# EAGLE design mini64se-v1.0.9-F4-2s (EAGLE 6.3)
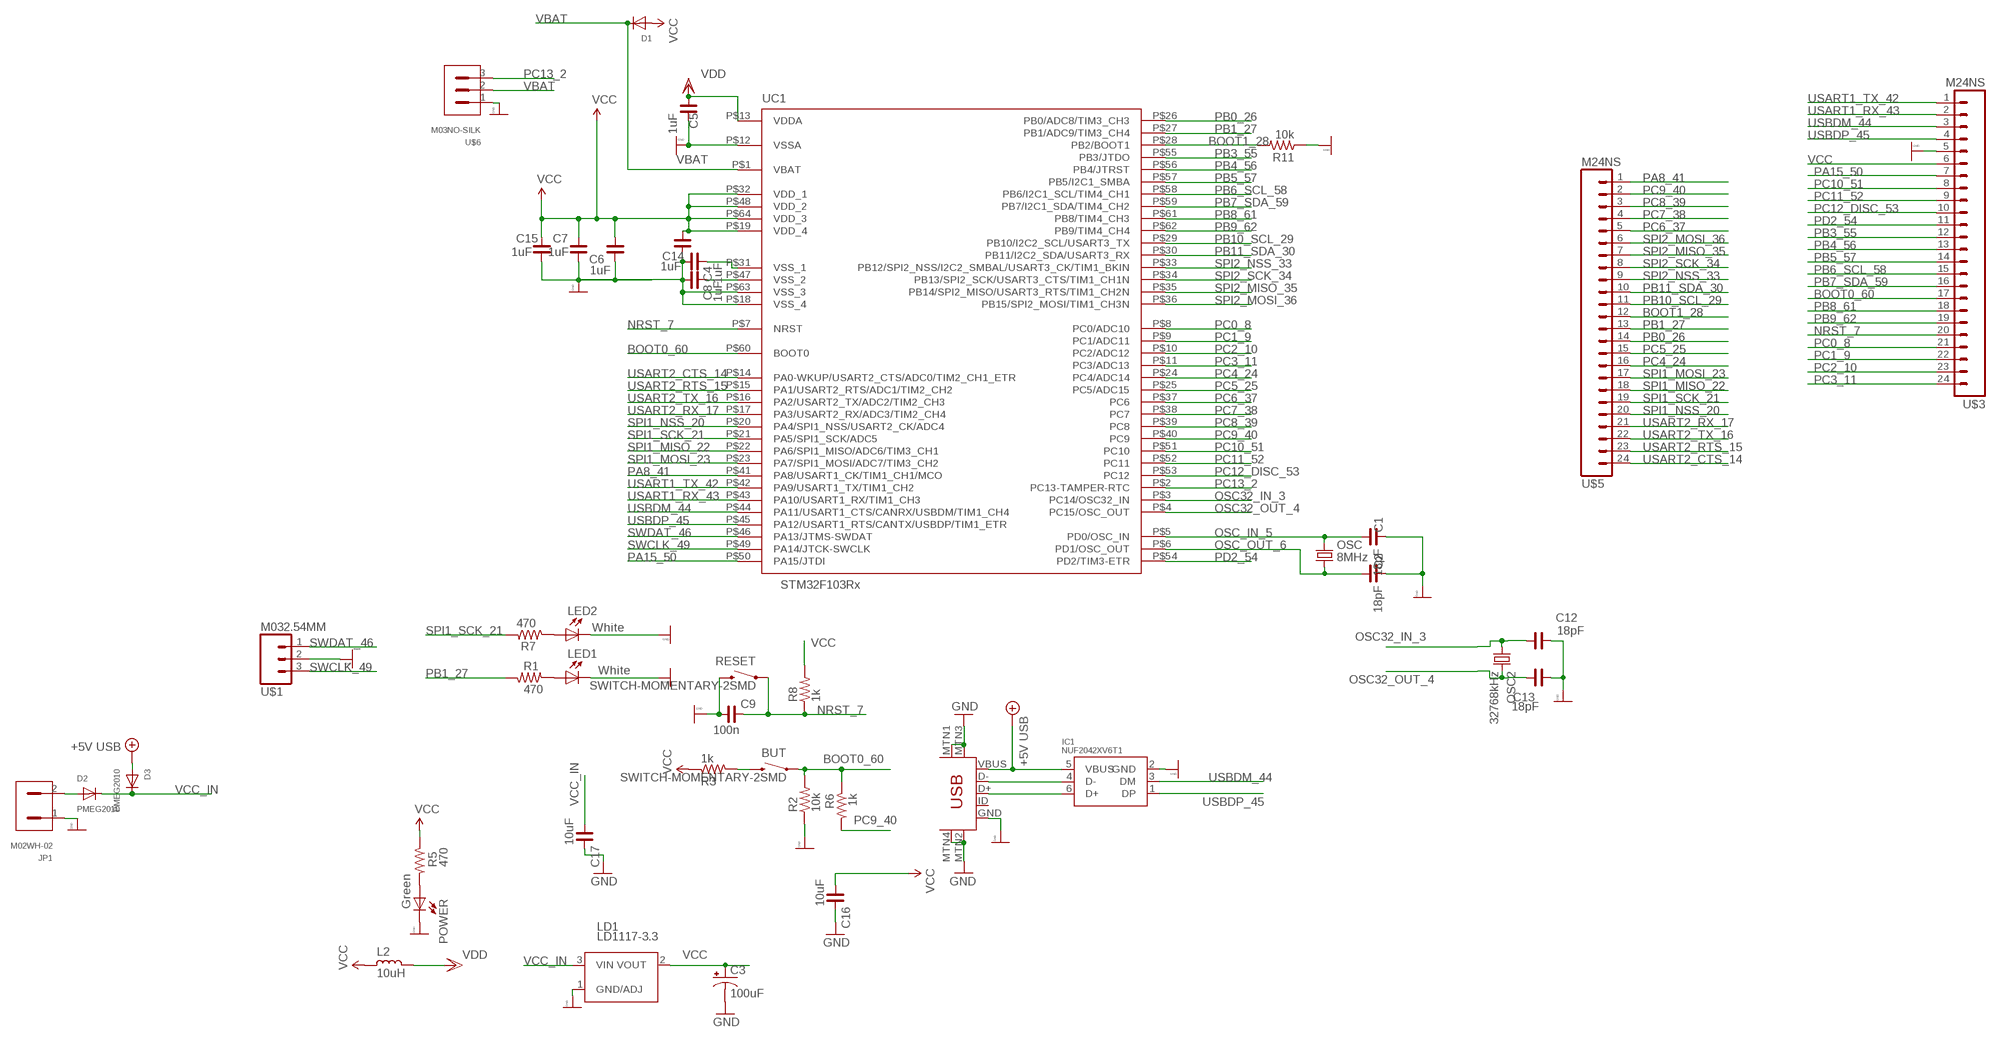
[diagram p0: schematic, sheet 1]

## Parts
BUT  SWITCH-MOMENTARY-2SMD  [TACTILE_SWITCH_SMD]
C1  18pF  C_0603  [C0603]
C2  18pF  C_0603  [C0603]
C3  100uF  CAP_POLC  [PANASONIC_C]
C4  1uF  C_0603  [C0603]
C5  1uF  C_0603  [C0603]
C6  1uF  C_0603  [C0603]
C7  1uF  C_0603  [C0603]
C8  1uF  C_0603  [C0603]
C9  100n  C_0603  [C0603]
C12  18pF  C_0603  [C0603]
C13  18pF  C_0603  [C0603]
C14  1uF  C_0603  [C0603]
C15  1uF  C_0603  [C0603]
C16  10uF  C_0805  [C0805]
C17  10uF  C_0805  [C0805]
D1  DIODESOD-123  [SOD-123]
D2  PMEG2010  DIODESOD-123  [SOD-123]
D3  PMEG2010  DIODESOD-123  [SOD-123]
IC1  NUF2042XV6T1  [SOT-563]
JP1  M02WH-02  [WH-02R]
L2  10uH  L_PM0603  [PM0603]
LD1  LD1117-3.3  LD1117SOT223  [SOT223]
LED1  White  LEDCHIPLED_1206  [CHIPLED_1206]
LED2  White  LEDCHIPLED_1206  [CHIPLED_1206]
OSC  8MHz  CRYSTALHC49UV  [HC49U-V]
OSC2  32768kHz  CRYSTALTC26HM  [TC26H-M]
POWER  Green  LEDCHIP-LED0805  [CHIP-LED0805]
R1  470  R_0603  [R0603]
R2  10k  R_0603  [R0603]
R3  1k  R_0603  [R0603]
R5  470  R_0603  [R0603]
R6  1k  R_0603  [R0603]
R7  470  R_0603  [R0603]
R8  1k  R_0603  [R0603]
R11  10k  R_0603  [R0603]
RESET  SWITCH-MOMENTARY-2SMD  [TACTILE_SWITCH_SMD]
U$1  M032.54MM  M031X03_NO_SILK  [1X03_NO_SILK]
U$3  M24NS  [1X24_NO_SILK]
U$5  M24NS  [1X24_NO_SILK]
U$6  M03NO-SILK  [1X03_NO_SILK]
UC1  STM32F103Rx  STM32F103  [TQFP-10X10-64]
USB  USB-MINIB-5PIN  [USB-MINIB]

## Nets
+5V [vcc]: D3.A IC1.5(VBUS) USB.VBUS ; supply symbol labelled +5V USB
BOOT0_60: BUT.1 R2.2 R6.1 U$3.17 UC1.P$60(BOOT0)
BOOT1_28: R11.2 U$5.12 UC1.P$28(PB2/BOOT1)
EXT_PWR [vcc]: D2.A JP1.2
GND: C1.1 C2.1 C3.- C4.2 C5.1 C6.1 C7.1 C8.2 C9.1 C12.1 C13.1 C14.1 C15.1 C16.2 C17.2 IC1.2(GND) JP1.1 LD1.1(GND/ADJ) LED1.C LED2.C POWER.C R2.1 R11.1 RESET.3 U$1.2 U$3.5 U$6.1 UC1.P$12(VSSA) UC1.P$18(VSS_4) UC1.P$63(VSS_3) USB.GND USB.MTN1(MTN2) USB.MTN2(MTN3) USB.MTN3(MTN1) USB.MTN4
N$1: POWER.A R5.2
N$2: BUT.3 R3.2
N$3: LED2.A R7.2
N$4: LED1.A R1.1
N$5: C4.1 UC1.P$31(VSS_1)
N$6: C8.1 UC1.P$47(VSS_2)
N$14: IC1.4(D-) USB.D-
N$17: IC1.6(D+) USB.D+
NRST_7: C9.2 R8.1 RESET.1 U$3.20 UC1.P$7(NRST)
OSC32_IN_3: C12.2 OSC2.1 UC1.P$3(PC14/OSC32_IN)
OSC32_OUT_4: C13.2 OSC2.2 UC1.P$4(PC15/OSC_OUT)
OSC_IN_5: C1.2 OSC.2 UC1.P$5(PD0/OSC_IN)
OSC_OUT_6: C2.2 OSC.1 UC1.P$6(PD1/OSC_OUT)
PA8_41: U$5.1 UC1.P$41(PA8/USART1_CK/TIM1_CH1/MCO)
PA15_50: U$3.7 UC1.P$50(PA15/JTDI)
PB0_26: U$5.14 UC1.P$26(PB0/ADC8/TIM3_CH3)
PB1_27: R1.2 U$5.13 UC1.P$27(PB1/ADC9/TIM3_CH4)
PB3_55: U$3.12 UC1.P$55(PB3/JTDO)
PB4_56: U$3.13 UC1.P$56(PB4/JTRST)
PB5_57: U$3.14 UC1.P$57(PB5/I2C1_SMBA)
PB6_SCL_58: U$3.15 UC1.P$58(PB6/I2C1_SCL/TIM4_CH1)
PB7_SDA_59: U$3.16 UC1.P$59(PB7/I2C1_SDA/TIM4_CH2)
PB8_61: U$3.18 UC1.P$61(PB8/TIM4_CH3)
PB9_62: U$3.19 UC1.P$62(PB9/TIM4_CH4)
PB10_SCL_29: U$5.11 UC1.P$29(PB10/I2C2_SCL/USART3_TX)
PB11_SDA_30: U$5.10 UC1.P$30(PB11/I2C2_SDA/USART3_RX)
PC0_8: U$3.21 UC1.P$8(PC0/ADC10)
PC1_9: U$3.22 UC1.P$9(PC1/ADC11)
PC2_10: U$3.23 UC1.P$10(PC2/ADC12)
PC3_11: U$3.24 UC1.P$11(PC3/ADC13)
PC4_24: U$5.16 UC1.P$24(PC4/ADC14)
PC5_25: U$5.15 UC1.P$25(PC5/ADC15)
PC6_37: U$5.5 UC1.P$37(PC6)
PC7_38: U$5.4 UC1.P$38(PC7)
PC8_39: U$5.3 UC1.P$39(PC8)
PC9_40: R6.2 U$5.2 UC1.P$40(PC9)
PC10_51: U$3.8 UC1.P$51(PC10)
PC11_52: U$3.9 UC1.P$52(PC11)
PC12_DISC_53: U$3.10 UC1.P$53(PC12)
PC13_2: U$6.3 UC1.P$2(PC13-TAMPER-RTC)
PD2_54: U$3.11 UC1.P$54(PD2/TIM3-ETR)
SPI1_MISO_22: U$5.18 UC1.P$22(PA6/SPI1_MISO/ADC6/TIM3_CH1)
SPI1_MOSI_23: U$5.17 UC1.P$23(PA7/SPI1_MOSI/ADC7/TIM3_CH2)
SPI1_NSS_20: U$5.20 UC1.P$20(PA4/SPI1_NSS/USART2_CK/ADC4)
SPI1_SCK_21: R7.1 U$5.19 UC1.P$21(PA5/SPI1_SCK/ADC5)
SPI2_MISO_35: U$5.7 UC1.P$35(PB14/SPI2_MISO/USART3_RTS/TIM1_CH2N)
SPI2_MOSI_36: U$5.6 UC1.P$36(PB15/SPI2_MOSI/TIM1_CH3N)
SPI2_NSS_33: U$5.9 UC1.P$33(PB12/SPI2_NSS/I2C2_SMBAL/USART3_CK/TIM1_BKIN)
SPI2_SCK_34: U$5.8 UC1.P$34(PB13/SPI2_SCK/USART3_CTS/TIM1_CH1N)
SWCLK_49: U$1.3 UC1.P$49(PA14/JTCK-SWCLK)
SWDAT_46: U$1.1 UC1.P$46(PA13/JTMS-SWDAT)
USART1_RX_43: U$3.2 UC1.P$43(PA10/USART1_RX/TIM1_CH3)
USART1_TX_42: U$3.1 UC1.P$42(PA9/USART1_TX/TIM1_CH2)
USART2_CTS_14: U$5.24 UC1.P$14(PA0-WKUP/USART2_CTS/ADC0/TIM2_CH1_ETR)
USART2_RTS_15: U$5.23 UC1.P$15(PA1/USART2_RTS/ADC1/TIM2_CH2)
USART2_RX_17: U$5.21 UC1.P$17(PA3/USART2_RX/ADC3/TIM2_CH4)
USART2_TX_16: U$5.22 UC1.P$16(PA2/USART2_TX/ADC2/TIM2_CH3)
USBDM_44: IC1.3(DM) U$3.3 UC1.P$44(PA11/USART1_CTS/CANRX/USBDM/TIM1_CH4)
USBDP_45: IC1.1(DP) U$3.4 UC1.P$45(PA12/USART1_RTS/CANTX/USBDP/TIM1_ETR)
VBAT: D1.C U$6.2 UC1.P$1(VBAT)
VCC [vcc]: C3.+ C6.2 C7.2 C14.2 C15.2 C16.1 D1.A L2.2 LD1.2(VOUT) R3.1 R5.1 R8.2 U$3.6 UC1.P$19(VDD_4) UC1.P$32(VDD_1) UC1.P$48(VDD_2) UC1.P$64(VDD_3)
VCC_IN [vcc]: C17.1 D2.C D3.C LD1.3(VIN)
VDD [vcc]: C5.2 L2.1 UC1.P$13(VDDA)
Unconnected: USB.ID

## Library data of the parts
BUT RESET = es:SWITCH-MOMENTARY-2
C1 C2 C4-C9 C12-C17 = rc-master-smd:C_: NON-POLARIZED CAP
C3 = es:CAP_POL: Capacitor Polarized These are standard SMD and PTH capacitors. Normally 10uF, 47uF, and 100uF in electrolytic and tantalum varieties. Always verify the external diameter of the through hole cap, it varies with capacity, voltage, and manufacturer. The EIA devices should be standard.
D1-D3 = es:DIODE: Diode SMADIODE - SMA Surface Mount Package 20V 1A Schottky Diode Digikey: 641-1014-6-ND DO-1N4148 - Through Hole Small Current Diode SOD-123 20V 1 A (.5mV Vf) Schottky Diode - Digikey: MBRX120TPMSCT-ND SOD-323 10V 570mA (.38mV Vf, 3ns) Schottky Diode - Digikey: ZLLS410CT-ND SOD-523 30V 30mA Schottky Diode (RB751S-40TE61) - Digikey: RB751S-40TE61CT-ND SOT23-R/W - SOT23 Package (R = Solder Paste/Reflow Ovens, W = Hand-Soldering) BAT54Film 40V 300mA - Digikey: 497-7162-1-ND
IC1 = es:NUF2042
JP1 = es:M02
L2 = rc-master-smd:L_: INDUCTOR
LD1 = es:LD1117
LED1 LED2 POWER = led:LED: LED OSRAM: - CHIPLED LG R971, LG N971, LY N971, LG Q971, LY Q971, LO R971, LY R971 LH N974, LH R974 LS Q976, LO Q976, LY Q976 LO Q996 - Hyper CHIPLED LW Q18S LB Q993, LB Q99A, LB R99A - SideLED LS A670, LO A670, LY A670, LG A670, LP A670 LB A673, LV A673, LT A673, LW A673 LH A674 LY A675 LS A676, LA A676, LO A676, LY A676, LW A676 LS A679, LY A679, LG A679 - Hyper Micro SIDELED® LS Y876, LA Y876, LO Y876, LY Y876 LT Y87S - SmartLED LW L88C, LW L88S LB L89C, LB L89S, LG L890 LS L89K, LO L89K, LY L89K LS L896, LA L896, LO L896, LY L896 - TOPLED LS T670, LO T670, LY T670, LG T670, LP T670 LSG T670, LSP T670, LSY T670, LOP T670, LYG T670 LG T671, LOG T671, LSG T671 LB T673, LV T673, LT T673, LW T673 LH T674 LS T676, LA T676, LO T676, LY T676, LB T676, LH T676, LSB T676, LW T676 LB T67C, LV T67C, LT T67C, LS T67K, LO T67K, LY T67K, LW E67C LS E67B, LA E67B, LO E67B, LY E67B, LB E67C, LV E67C, LT E67C LW T67C LS T679, LY T679, LG T679 LS T770, LO T770, LY T770, LG T770, LP T770 LB T773, LV T773, LT T773, LW T773 LH T774 LS E675, LA E675, LY E675, LS T675 LS T776, LA T776, LO T776, LY T776, LB T776 LHGB T686 LT T68C, LB T68C - Hyper Mini TOPLED® LB M676 - Mini TOPLED Santana® LG M470 LS M47K, LO M47K, LY M47K Source: http://www.osram.convergy.de LUXEON: - LUMILED® LXK2-PW12-R00, LXK2-PW12-S00, LXK2-PW14-U00, LXK2-PW14-V00 LXK2-PM12-R00, LXK2-PM12-S00, LXK2-PM14-U00 LXK2-PE12-Q00, LXK2-PE12-R00, LXK2-PE12-S00, LXK2-PE14-T00, LXK2-PE14-U00 LXK2-PB12-K00, LXK2-PB12-L00, LXK2-PB12-M00, LXK2-PB14-N00, LXK2-PB14-P00, LXK2-PB14-Q00 LXK2-PR12-L00, LXK2-PR12-M00, LXK2-PR14-Q00, LXK2-PR14-R00 LXK2-PD12-Q00, LXK2-PD12-R00, LXK2-PD12-S00 LXK2-PH12-R00, LXK2-PH12-S00 LXK2-PL12-P00, LXK2-PL12-Q00, LXK2-PL12-R00 Source: www.luxeon.com KINGBRIGHT: KA-3528ASYC Source: www.kingbright.com
OSC OSC2 = SparkFun_20110922_my:CRYSTAL: Crystals Various standard crystals. Proven footprints. Spark Fun Electronics SKU : COM-00534
R1-R3 R5-R8 R11 = rc-master-smd:R_: RESISTOR
U$1 = SparkFun_20110922_my:M03: Header 3 Standard 3-pin 0.1" header. Use with straight break away headers (SKU : PRT-00116), right angle break away headers (PRT-00553), swiss pins (PRT-00743), machine pins (PRT-00117), and female headers (PRT-00115). Molex polarized connector foot print use with SKU : PRT-08232 with associated crimp pins and housings.
U$3 U$5 = SparkFun_20110922_my:M24
U$6 = es:M03
UC1 = st-microelectronics:STM32F103
USB = SparkFun_20110922_my:USB-MINIB: Mini-USB "B" connector with 5th pin broken out. Created new symbol breaking out 5th "ID" pin in mini/micro USB connector spec. See: http://en.wikipedia.org/wiki/Mini_usb#Cables. Uses same footprint as 4-pin symbol. Also added pins to connect to mounting / shield pads if required (probably not generally needed as signals aren't shielded once they leave the connector).

## Net classes
1 vcc: width 0.3 mm

## Board
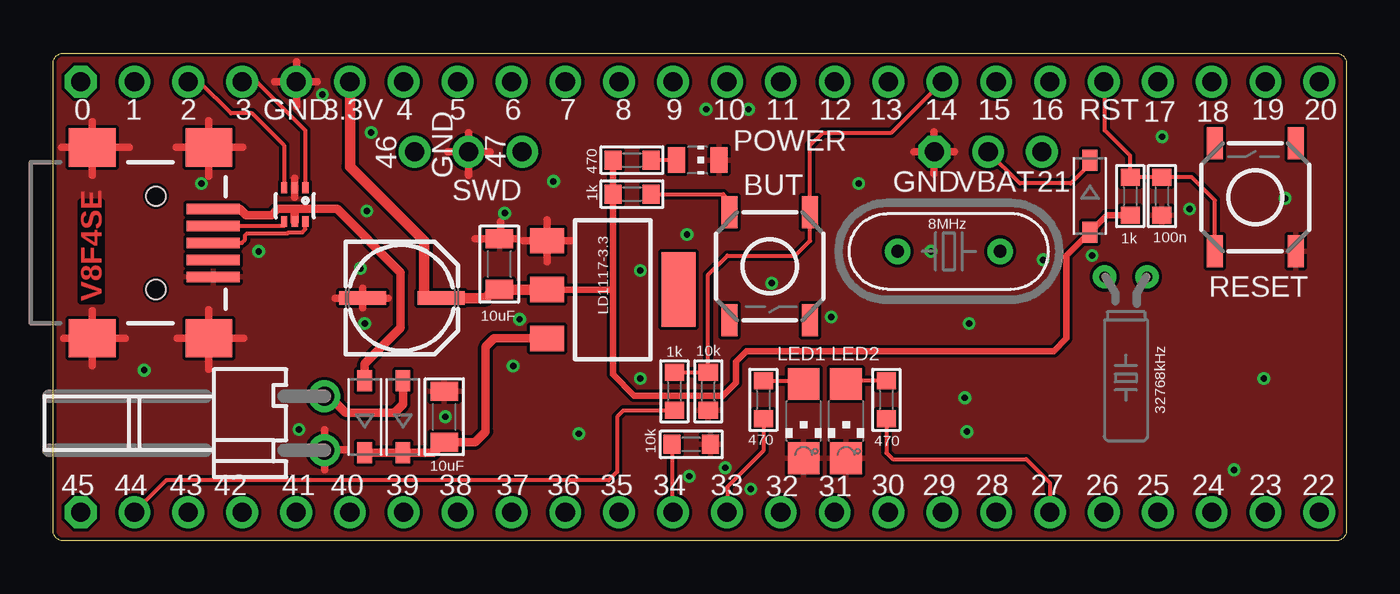
[diagram p1: board, top side]
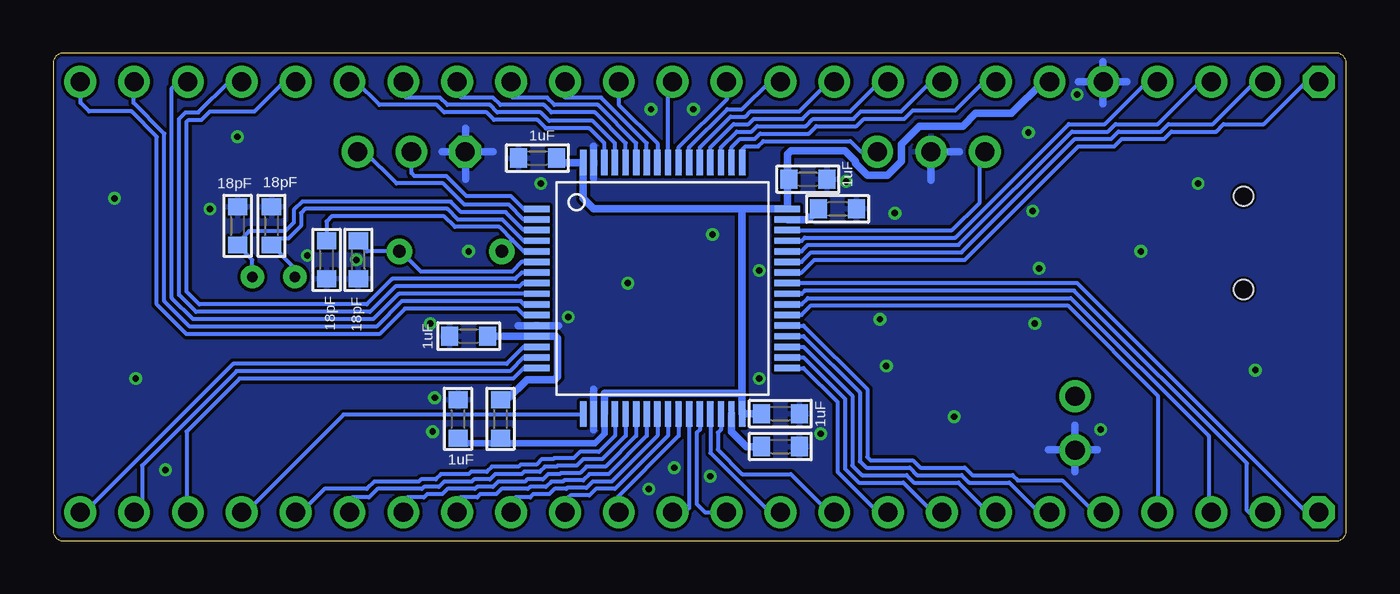
[diagram p2: board, bottom side, seen from below]

Size 61 x 23 mm. Coordinates in mm from the lower left corner, seen from the top.
Outline: 0.5,23 60.5,23 arc-90 61,22.5 61,0.5 arc-90 60.5,0 0.5,0 arc-90 0,0.5 0,22.5 arc-90 0.5,23
Copper layers (1+2*3+16): Top 0.07mm / dielectric 9mil / Route2 0.07mm / dielectric 35mil / Route3 0.07mm / dielectric 9mil / Bottom 0.07mm
Design rules "es-015mm *": minimum track width 0.15mm, minimum drill 0.3mm, track to track 0.15mm, track to pad 0.15mm, pad to pad 0.15mm, via to via 0.15mm, smd to smd 0.15mm, copper to edge 0.15mm, drill to drill 0.15mm, minimum pad ring 0.3mm, minimum via ring 0.15mm, stop-mask expansion 0mil, vias tented up to drill 25mil, thermal gap 0.15mm

### Footprints (pad centres in the part's own frame; a part is rotated, then mirrored left to right if it is on the bottom)
TACTILE_SWITCH_SMD = smd 1.5 x 0.75: 1 -2.54,1.905; 2 2.54,1.905; 3 -2.54,-1.905; 4 2.54,-1.905
C0603 = smd 0.8 x 0.9: 1 -0.9,0; 2 0.9,0
PANASONIC_C = smd 2.2 x 0.65: + 1.9,0; - -1.8,0
C0805 = smd 0.9 x 1.3: 1 -1.2,0; 2 1.2,0
SOD-123 = smd 1 x 0.7: A 1.7,0; C -1.7,0
SOT-563 = smd 0.3 x 0.5: 1 -0.5,-0.8; 2 0,-0.8; 3 0.5,-0.8; 4 0.5,0.8; 5 0,0.8; 6 -0.5,0.8
WH-02R = drill 0.9: 1 -1.8,1.27; 2 -1.8,-1.27
PM0603 = smd 0.8 x 0.9: 1 -0.9,0; 2 0.9,0
SOT223 = smd 1.2 x 1.6: 1 -2.3,-3.1; 2 0,-3.1; 3 2.3,-3.1 | smd 3.5 x 1.6: 4 0,3.1
CHIPLED_1206 = smd 1.5 x 1.5: A 0,-1.75; C 0,1.75
HC49U-V = drill 0.6: 1 -2.413,0; 2 2.413,0
TC26H-M = drill 0.5: 1 -1,0; 2 1,0
CHIP-LED0805 = smd 1.2 x 0.8: A 0,-1; C 0,1
R0603 = smd 0.8 x 0.9: 1 -0.9,0; 2 0.9,0
1X03_NO_SILK = drill 0.9: 1 0,0; 2 2.54,0; 3 5.08,0
1X24_NO_SILK = drill 0.9 octagon: 1 -29.2,0 | drill 0.9: 2 -26.66,0; 3 -24.12,0; 4 -21.58,0; 5 -19.04,0; 6 -16.5,0; 7 -13.96,0; 8 -11.42,0; 9 -8.88,0; 10 -6.34,0; 11 -3.8,0; 12 -1.26,0; 13 1.28,0; 14 3.82,0; 15 6.36,0; 16 8.9,0; 17 11.44,0; 18 13.98,0; 19 16.52,0; 20 19.06,0; 21 21.6,0; 22 24.14,0; 23 26.68,0; 24 29.22,0
1X03_NO_SILK' = drill 0.9 octagon: 1 -2.54,0 | drill 0.9: 2 0,0; 3 2.54,0
TQFP-10X10-64 = smd 1.2 x 0.3: P$1 -5.936,3.75; P$2 -5.936,3.25; P$3 -5.936,2.75; P$4 -5.936,2.25; P$5 -5.936,1.75; P$6 -5.936,1.25; P$7 -5.936,0.75; P$8 -5.936,0.25; P$9 -5.936,-0.25; P$10 -5.936,-0.75; P$11 -5.936,-1.25; P$12 -5.936,-1.75; P$13 -5.936,-2.25; P$14 -5.936,-2.75; P$15 -5.936,-3.25; P$16 -5.936,-3.75; P$33 5.886,-3.75; P$34 5.886,-3.25; P$35 5.886,-2.75; P$36 5.886,-2.25; P$37 5.886,-1.75; P$38 5.886,-1.25; P$39 5.886,-0.75; P$40 5.886,-0.25; P$41 5.886,0.25; P$42 5.886,0.75; P$43 5.886,1.25; P$44 5.886,1.75; P$45 5.886,2.25; P$46 5.886,2.75; P$47 5.886,3.25; P$48 5.886,3.75 | smd 0.3 x 1.2: P$17 -3.75,-5.911; P$18 -3.25,-5.911; P$19 -2.75,-5.911; P$20 -2.25,-5.911; P$21 -1.75,-5.911; P$22 -1.25,-5.911; P$23 -0.75,-5.911; P$24 -0.25,-5.911; P$25 0.25,-5.911; P$26 0.75,-5.911; P$27 1.25,-5.911; P$28 1.75,-5.911; P$29 2.25,-5.911; P$30 2.75,-5.911; P$31 3.25,-5.911; P$32 3.75,-5.911; P$49 3.75,5.936; P$50 3.25,5.936; P$51 2.75,5.936; P$52 2.25,5.936; P$53 1.75,5.936; P$54 1.25,5.936; P$55 0.75,5.936; P$56 0.25,5.936; P$57 -0.25,5.936; P$58 -0.75,5.936; P$59 -1.25,5.936; P$60 -1.75,5.936; P$61 -2.25,5.936; P$62 -2.75,5.936; P$63 -3.25,5.936; P$64 -3.75,5.936
USB-MINIB = smd 2.5 x 0.5: D+ 2.7,0; D- 2.7,0.8; GND 2.7,-1.6; ID 2.7,-0.8; VBUS 2.7,1.6 | smd 2.2 x 1.8: MTN1 -3,4.5; MTN2 2.5,4.5; MTN3 -3,-4.5; MTN4 2.5,-4.5 | hole 0.9: 0,2.2; 0,-2.2

### Placement (x,y rotation side)
BUT  33.8,12.95 270 top
C1  48.1,13.25 90 bottom
C2  46.6,13.25 90 bottom
C3  16.4,11.45 0 top
C4  26.7,4.45 0 bottom
C5  41.4,9.65 0 bottom
C6  25.4,17.05 180 bottom
C7  26.7,6 180 bottom
C8  24,15.65 0 bottom
C9  52.3,16.25 90 top
C12  52.3,14.85 270 bottom
C13  50.7,14.85 270 bottom
C14  38.15,18.05 0 bottom
C15  41.9,5.75 270 bottom
C16  21.05,13.05 90 top
C17  18.45,5.85 90 top
D1  48.9,16.25 270 top
D2  16.5,5.85 90 top
D3  14.7,5.85 90 top
IC1  11.4,15.85 180 top
JP1  11,5.55 180 top
L2  39.9,5.75 270 bottom
LD1  26.4,11.85 270 top
LED1  35.4,5.65 180 top
LED2  37.4,5.65 180 top
OSC  42.25,13.65 180 top
OSC2  50.6,12.45 180 top
POWER  30.4,17.95 270 top
R1  33.5,6.65 270 top
R2  30.9,7.05 90 top
R3  27.3,16.35 0 top
R5  27.3,17.95 0 top
R6  29.3,7.05 270 top
R7  39.3,6.65 90 top
R8  50.8,16.25 270 top
R11  30.1,4.55 180 top
RESET  56.7,16.2 90 top
U$1  17.05,18.35 0 top
U$3  30.5,21.65 0 top
U$5  30.5,1.35 180 bottom
U$6  M03NO-SILK  [1X03_NO_SILK']  44.1,18.35 0 top
UC1  32.25,11.9 0 bottom
USB  4.85,14.05 0 top

### Tracks (layer width: path | path; a pad name or v marks a point on that pad's centre or on a via)
+5V
  Top 0.4: USB.VBUS 8.8,15.65 9.1,15.35 10.3,15.35 10.6,15.65 11.4,15.65 | 11.4,15.65 13.4,15.65 16.4,12.65 16.4,10.05 14.7,8.35 D3.A | IC1.5 11.4,15.65
BOOT0_60
  Top 0.2: U$3.17 39.54,19.25 36.3,19.25 35.7,18.66 BUT.1 35.7,14.15 35,13.45 31.8,13.45 30.9,12.55 R2.2 R6.1
  Bottom 0.2: UC1.P$60 34,18.75 35.45,20.2 37.5,20.2 37.85,20.55 39.9,20.55 40.25,20.9 41.75,20.9 41.9,21.05 41.9,21.65 U$3.17
BOOT1_28
  Top 0.2: R11.2 29.2,1.45 arc45 U$5.12
  Bottom 0.2: UC1.P$28 30.5,5.25 30.65,5.1 30.65,1.75 30.25,1.35 U$5.12
EXT_PWR
  Top 0.4: JP1.2 13.03,6.82 13.8,6.05 16.1,6.05 16.5,6.45 D2.A
GND  (via drill 0.3)
  Top 0.35: 11.4,16.2 11.4,17.1 | 8.95,18.55 8.05,18.55 | 7.35,19.8 7.35,18.9 | 7.35,18.1 7.35,17.2 | 7.35,10.9 7.35,10 | 7.35,9 7.35,8.1 | 8.1,9.55 9,9.55 | 5.85,9.55 6.75,9.55 | 5.8,18.55 6.7,18.55 | 2.7,18.55 3.6,18.55 | 0.4,18.55 1.3,18.55 | 2.5,9.55 3.4,9.55 | 0.5,9.55 1.4,9.55 | 1.85,10.85 1.85,9.95 | 1.85,9.15 1.85,8.25 | 1.85,18.15 1.85,17.25 | 1.85,19.75 1.85,18.85 | 12.8,4.25 12.8,3.35 | 12.9,4.3 13.8,4.3 | 12.8,4.35 12.8,5.25 | 12.6,4.3 11.7,4.3 | 14.6,11.9 14.6,11 | 13.3,11.45 14.2,11.45 | 14.9,11.45 15.8,11.45 | 23.3,13.15 23.3,14.05 | 23.3,14.25 23.3,15.15 | 24.5,14.15 23.6,14.15 | 23.1,14.15 22.2,14.15 | 21.1,15.05 21.1,14.15 | 19.9,14.25 20.8,14.25 | 21,14.25 21.9,14.25 | 19.6,17.25 19.6,18.15 | U$1.2 19.6,19.25 | 20.6,18.35 19.7,18.35 | 19.5,18.35 18.6,18.35 | 41.5,18.35 40.6,18.35 | 42.5,18.35 41.6,18.35 | 41.55,19.3 41.55,18.4 | 10.45,21.65 11.35,21.65 | 11.55,21.65 12.45,21.65 | 11.5,21.7 11.5,22.6 | 11.5,20.5 11.5,21.45 | 41.55,18.2 41.55,17.3
  Bottom 0.35: 35.5,5.25 35.5,7.15 | 35.5,17.1 35.5,18.6 | 37.16,10.15 39.06,10.15 | 19.6,17 19.6,18.5 | 19.75,18.35 18.25,18.35 | 42.65,18.35 40.25,18.35 | 41.55,19.45 41.55,17.05 | 11.5,22.6 11.5,20.6 | 10.35,21.65 12.65,21.65 | 11.75,4.3 14.05,4.3 | 12.8,5.45 12.8,3.25
  other vias: 4.3,8.05 9.7,13.65 7,16.85 14.8,15.55 14.7,10.25 14.5,12.85 11.6,5.25 18.5,5.85 21.3,15.45 22,10.45 27.7,12.75 29.9,14.45 33.9,12.15 23.6,16.95 38,16.85 53.6,15.65 41.4,13.65 46.7,13.25 49,13.45 43.2,10.25 36.7,10.55 43,6.75 43.1,5.15 55.7,3.35 57.1,7.65 58.1,16.15 52.3,19.05 32.8,20.35 30.8,20.35 21.7,8.25 24.8,5.05 27.7,7.65 30,3.05 31.7,3.45 32.9,2.45 15,19.25 12.7,21.05
  pour Bottom: 61,23 61,0 0,0 0,23
  pour Top: 61,23 61,0 0,0 0,23
N$1
  Top 0.2: POWER.A R5.2
N$2
  Top 0.2: R3.2 31.6,16.35 31.9,16.05 BUT.3
N$3
  Top 0.2: R7.2 37.55,7.55 LED2.A
N$4
  Top 0.2: R1.1 35.25,7.55 LED1.A
N$5
  Bottom 0.35: UC1.P$31 29,5.15 28.3,4.45 C4.1
N$6
  Bottom 0.35: UC1.P$47 25.4,15.15 C8.1
N$14
  Top 0.2: USB.D- 10.9,14.85 IC1.4
N$17
  Top 0.2: USB.D+ 8.9,14.05 9.05,14.2 9.05,14.4 9.15,14.5 11.05,14.5 11.1,14.55 11.75,14.55 11.9,14.7 IC1.6
NRST_7
  Top 0.2: U$3.20 49.6,21.61 49.6,19.35 49.6,19.36 50.8,18.16 R8.1 C9.2 53.7,17.15 54.79,16.05 RESET.1
  Bottom 0.2: UC1.P$7 38.9,12.65 39.2,12.35 45,12.35 46.2,11.15 54.1,11.15 54.7,11.75 54.7,19.75 54.6,19.85 54,19.85 53.6,20.25 51.5,20.25 50.1,21.65 U$3.20
OSC32_IN_3
  Bottom 0.2: UC1.P$3 38.8,14.65 39.65,15.5 41.75,15.5 42.25,16 49.25,16 49.65,15.6 49.65,15 50.05,14.6 51.75,14.6 52.3,14.05 C12.2 51.6,13.25 OSC2.1
OSC32_OUT_4
  Bottom 0.2: UC1.P$4 38.8,14.15 39.8,15.15 41.9,15.15 42.4,15.65 49.1,15.65 49.3,15.45 49.3,14.85 49.9,14.25 50.4,14.25 C13.2 49.6,12.85 OSC2.2
OSC_IN_5
  Bottom 0.2: UC1.P$5 38.8,13.65 39.35,14.2 | 39.35,14.2 39.95,14.8 42.05,14.8 42.55,15.3 47.85,15.3 48.1,15.05 C1.2 | OSC.2 39.84,13.71 39.35,14.2
OSC_OUT_6
  Bottom 0.2: UC1.P$6 38.9,13.15 39.35,12.7 43.65,12.7 44.6,13.65 OSC.1 46.2,13.65 46.6,14.05 C2.2
PA8_41
  Bottom 0.2: U$5.1 1.9,1.35 12.7,12.15 UC1.P$41
PA15_50
  Bottom 0.2: UC1.P$50 29,18.55 28.6,18.95 27.9,18.95 27.65,19.2 25.35,19.2 25,19.55 23.1,19.55 22.75,19.9 20.85,19.9 20.45,20.3 18.45,20.3 17.1,21.65 U$3.7
PB0_26
  Bottom 0.2: UC1.P$26 31.5,4.95 34.6,1.85 34.6,1.35 U$5.14
PB1_27
  Top 0.2: R1.2 33.5,4.25 31.8,2.55 31.8,1.37 U$5.13
  Bottom 0.2: UC1.P$27 31,1.55 31.2,1.35 U$5.13
PB3_55
  Bottom 0.2: UC1.P$55 31.5,18.55 29.2,20.85 29.2,21.61 U$3.12
PB4_56
  Bottom 0.2: UC1.P$56 32,21.43 U$3.13
PB5_57
  Bottom 0.2: U$3.14 34.32,20.57 32.5,18.75 UC1.P$57
PB6_SCL_58
  Bottom 0.2: UC1.P$58 33,18.75 35.15,20.9 36.85,20.9 36.9,20.95 36.9,21.61 U$3.15
PB7_SDA_59
  Bottom 0.2: UC1.P$59 33.5,18.75 35.3,20.55 37.35,20.55 37.7,20.9 39.35,20.9 39.35,21.65 U$3.16
PB8_61
  Bottom 0.2: UC1.P$61 34.5,18.75 35.55,19.8 37.6,19.8 38,20.2 40.05,20.2 40.4,20.55 42.4,20.55 42.75,20.9 44.35,20.9 44.35,21.65 U$3.18
PB9_62
  Bottom 0.2: UC1.P$62 35,18.75 35.7,19.45 37.75,19.45 38.15,19.85 40.2,19.85 40.55,20.2 42.55,20.2 42.9,20.55 45.6,20.55 46.7,21.65 U$3.19
PB10_SCL_29
  Bottom 0.2: UC1.P$29 30,4.15 27.2,1.35 U$5.11
PB11_SDA_30
  Bottom 0.2: UC1.P$30 29.5,5.25 29.65,5.1 29.65,4.3 28.5,3.15 26.2,3.15 24.4,1.35 U$5.10
PC0_8
  Bottom 0.2: UC1.P$8 38.85,12.15 39,12 44.85,12 46.05,10.8 54.25,10.8 55.05,11.6 55.05,19.9 54.75,20.2 54.15,20.2 52.7,21.65 U$3.21
PC1_9
  Bottom 0.2: UC1.P$9 44.7,11.65 45.9,10.45 54.4,10.45 55.4,11.45 55.4,21.35 55.1,21.65 U$3.22
PC2_10
  Bottom 0.2: UC1.P$10 38.8,11.15 38.95,11.3 44.55,11.3 45.75,10.1 54.55,10.1 55.75,11.3 55.75,19.2 57.2,20.65 57.2,21.63 U$3.23
PC3_11
  Bottom 0.2: UC1.P$11 38.8,10.65 39.1,10.95 44.4,10.95 45.6,9.75 54.7,9.75 56.1,11.15 56.1,19.05 57.3,20.25 59.3,20.25 59.7,20.65 59.7,21.63 U$3.24
PC4_24
  Bottom 0.2: UC1.P$24 32.5,4.95 34.65,2.8 35.55,2.8 35.85,2.5 36.75,2.5 36.8,2.45 37.35,2.45 37.6,2.2 38.35,2.2 38.5,2.05 39.2,2.05 39.3,1.95 39.3,1.35 U$5.16
PC5_25
  Bottom 0.2: UC1.P$25 32,4.95 34.5,2.45 35.4,2.45 35.7,2.15 36.6,2.15 36.7,2.05 36.7,1.35 U$5.15
PC6_37
  Bottom 0.2: UC1.P$37 25.6,10.15 22.6,7.15 22.6,3.95 22.45,3.8 20.45,3.8 20.1,3.45 18,3.45 17.65,3.1 15.75,3.1 15.5,2.85 13.4,2.85 11.9,1.35 U$5.5
PC7_38
  Bottom 0.2: UC1.P$38 25.7,10.65 25.25,11.1 13.15,11.1 8.9,6.85 8.9,1.37 U$5.4
PC8_39
  Bottom 0.2: UC1.P$39 25.7,11.15 25.4,11.45 13,11.45 6.5,4.95 6.5,1.47 U$5.3
PC9_40
  Top 0.2: U$5.2 5.34,2.85 26.2,2.85 26.6,3.25 26.6,5.85 26.9,6.15 R6.2
  Bottom 0.2: U$5.2 4.6,1.35 4.7,1.45 4.7,3.65 12.85,11.8 25.55,11.8 25.7,11.65 UC1.P$40
PC10_51
  Bottom 0.2: UC1.P$51 29.5,18.55 28.75,19.3 28.05,19.3 27.8,19.55 25.5,19.55 25.15,19.9 23.25,19.9 22.9,20.25 21,20.25 19.6,21.65 U$3.8
PC11_52
  Bottom 0.2: UC1.P$52 30,18.55 28.9,19.65 28.2,19.65 27.95,19.9 25.65,19.9 25.3,20.25 23.4,20.25 22,21.65 U$3.9
PC12_DISC_53
  Top 0.2: U$3.10 24.1,21.65
  Bottom 0.2: UC1.P$53 30.5,18.55 29.05,20 28.35,20 28.1,20.25 25.8,20.25 24.4,21.65 U$3.10
PC13_2
  Bottom 0.2: UC1.P$2 38.8,15.15 39.5,15.85 41.6,15.85 42.6,16.85 44.8,16.85 46.3,18.35 U$6.3
PD2_54
  Bottom 0.2: UC1.P$54 31,18.55 29.2,20.35 28.5,20.35 27.2,21.65 U$3.11
SPI1_MISO_22
  Bottom 0.2: UC1.P$22 33.5,4.95 34.95,3.5 35.85,3.5 36.15,3.2 37.05,3.2 37.1,3.15 37.65,3.15 37.9,2.9 38.65,2.9 38.75,2.8 40,2.8 40.25,2.55 41,2.55 41.1,2.45 42.4,2.45 42.65,2.2 43.35,2.2 43.5,2.05 44.3,2.05 44.4,1.95 44.4,1.35 U$5.18
SPI1_MOSI_23
  Bottom 0.2: UC1.P$23 33,4.95 34.8,3.15 35.7,3.15 36,2.85 36.9,2.85 36.95,2.8 37.5,2.8 37.75,2.55 38.5,2.55 38.6,2.45 39.85,2.45 40.1,2.2 40.85,2.2 41,2.05 41.8,2.05 41.9,1.95 41.9,1.35 U$5.17
SPI1_NSS_20
  Bottom 0.2: UC1.P$20 34.5,4.95 35.25,4.2 36.15,4.2 36.45,3.9 37.35,3.9 37.4,3.85 37.95,3.85 38.2,3.6 38.95,3.6 39.05,3.5 40.3,3.5 40.55,3.25 41.3,3.25 41.4,3.15 42.7,3.15 42.95,2.9 43.65,2.9 43.75,2.8 45.85,2.8 46.2,2.45 48.2,2.45 49.3,1.35 U$5.20
SPI1_SCK_21
  Top 0.2: R7.1 39.3,4.15 39.6,3.85 45.9,3.85 47,2.75 47,1.37 U$5.19
  Bottom 0.2: UC1.P$21 34,4.95 35.1,3.85 36,3.85 36.3,3.55 37.2,3.55 37.25,3.5 37.8,3.5 38.05,3.25 38.8,3.25 38.9,3.15 40.15,3.15 40.4,2.9 41.15,2.9 41.25,2.8 42.55,2.8 42.8,2.55 43.5,2.55 43.6,2.45 45.7,2.45 46.1,2.05 46.9,2.05 47,1.95 47,1.35 U$5.19
SPI2_MISO_35
  Bottom 0.2: UC1.P$35 25.6,9.15 23.3,6.85 23.3,3.55 22.85,3.1 20.75,3.1 20.4,2.75 18.3,2.75 16.9,1.35 U$5.7
SPI2_MOSI_36
  Bottom 0.2: UC1.P$36 25.6,9.65 22.95,7 22.95,3.75 22.65,3.45 20.6,3.45 20.25,3.1 18.15,3.1 17.8,2.75 15.9,2.75 14.5,1.35 U$5.6
SPI2_NSS_33
  Bottom 0.2: UC1.P$33 25.6,8.15 24,6.55 24,3.25 22.1,1.35 U$5.9
SPI2_SCK_34
  Bottom 0.2: UC1.P$34 25.6,8.65 23.65,6.7 23.65,3.4 23,2.75 20.9,2.75 19.5,1.35 U$5.8
SWCLK_49
  Bottom 0.2: UC1.P$49 28.5,18.45 28.35,18.6 27.75,18.6 27.5,18.85 23.4,18.85 22.9,18.35 U$1.3
SWDAT_46
  Bottom 0.2: UC1.P$46 18.6,14.65 17.3,15.95 17.3,18.35 U$1.1
USART1_RX_43
  Bottom 0.2: UC1.P$43 25.7,13.15 25.25,13.6 18.15,13.6 12.8,18.95 11.1,18.95 10.75,19.3 8.75,19.3 8.4,19.65 6.3,19.65 4.3,21.65 U$3.2
USART1_TX_42
  Bottom 0.2: UC1.P$42 25.7,12.65 25.1,13.25 18,13.25 12.65,18.6 10.95,18.6 10.6,18.95 8.6,18.95 8.25,19.3 6.15,19.3 5.8,19.65 3.9,19.65 1.9,21.65 U$3.1
USART2_CTS_14
  Bottom 0.2: UC1.P$14 38.8,9.15 39.6,8.35 52.5,8.35 59.5,1.35 U$5.24
USART2_RTS_15
  Bottom 0.2: UC1.P$15 38.8,8.65 39.45,8 52.35,8 56.8,3.55 56.8,1.35 U$5.23
USART2_RX_17
  Bottom 0.2: UC1.P$17 36,5.95 47.3,5.95 51.9,1.35 U$5.21
USART2_TX_16
  Bottom 0.2: UC1.P$16 38.8,8.15 39.3,7.65 52.2,7.65 54.7,5.15 54.7,1.35 U$5.22
USBDM_44
  Top 0.2: U$3.3 6.9,21.65 8.4,20.15 9.4,20.15 10.9,18.65 IC1.3
  Bottom 0.2: UC1.P$44 25.7,13.65 25.4,13.95 18.3,13.95 12.95,19.3 11.25,19.3 10.9,19.65 8.9,19.65 6.9,21.65 U$3.3
USBDP_45
  Top 0.2: U$3.4 9.6,21.65 11.9,19.35 IC1.1
  Bottom 0.2: UC1.P$45 25.7,14.15 25.55,14.3 18.45,14.3 13.1,19.65 11.4,19.65 9.4,21.65 U$3.4
VBAT
  Top 0.2: D1.C 48.9,17.75 48,16.85 45.6,16.85 U$6.2
  Bottom 0.2: UC1.P$1 38.8,15.65 39.4,16.25 41.5,16.25 42.45,17.2 43.95,17.2 44.1,17.35 U$6.2
VCC
  Top 0.3: R8.2 49.7,15.35 D1.A 47.8,13.45 47.8,9.55 47.2,8.95 32.7,8.95 32.2,8.45 32.2,7.45 31.6,6.85 27.4,6.85 26.4,7.85 26.4,11.85 | R5.1 R3.1 26.4,11.85 | 26.4,11.85 LD1.2
  Top 0.5: U$3.6 14,17.65 17.5,14.15 17.5,11.45 C3.+ 20.4,11.45 20.8,11.85 C16.1 LD1.2
  Bottom 0.3: UC1.P$19 35,5.05 35.45,4.6 39.9,4.6 | 39.9,4.6 41.9,4.6 C15.2 | L2.2 39.9,4.6
  Bottom 0.35: UC1.P$19 35,6.95 28.5,6.95 | 28.5,15.65 35.5,15.65 36,16.15 UC1.P$64 37.04,17.84 C14.2 | 28.5,6.95 28.5,15.65 | 28.5,15.65 UC1.P$48 26.36,16.95 | 28.5,6.95 UC1.P$32 C7.2 | U$3.6 14.3,21.65 15.8,20.15 17.5,20.15 18.1,19.55 20.15,19.55 21,18.7 21,17.9 21.65,17.25 22.6,17.25 23.15,17.8 23.15,17.9 23.65,18.4 26.2,18.4 26.36,18.24 26.36,16.95 | C6.2 26.3,17.01 26.36,16.95
VCC_IN
  Top 0.4: D3.C D2.C 17.95,4.15 C17.1 19.9,4.65 20.4,5.15 20.4,9.15 20.8,9.55 LD1.3
VDD
  Bottom 0.35: C5.2 UC1.P$13 37.3,9.65 37.2,9.55 37.2,7.75 37.35,7.6 38.65,7.6 39.6,6.65 L2.1
(copper drawn outside any net)
  shapes: Top circle x2

### Text on the board
Top: V8F4SE
tPlace: 0 | 1 | 2 | 3 | GND | 3.3V | 4 | 5 | 6 | 7 | 8 | 9 | 10 | 11 | 12 | 13 | 14 | 15 | 16 | RST | 17 | 18 | 19 | 20 | 46 | 47 | GND | GND | VBAT | 21 | SWD | 45 | 44 | 43 | 42 | 41 | 40 | 39 | 38 | 37 | 36 | 35 | 34 | 33 | 32 | 31 | 30 | 29 | 28 | 27 | 26 | 25 | 24 | 23 | 22